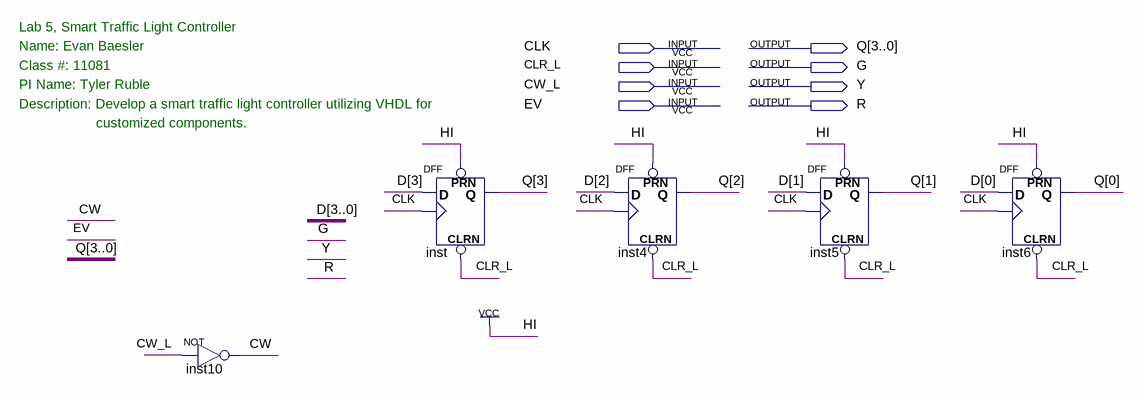
[diagram p0: schematic sheet]
// Quartus schematic Lab5_DFF_Traf_Cont.bdf as structural Verilog: 5 symbols, 8 pins
module Lab5_DFF_Traf_Cont (
  input  CLK,
  input  CLR_L,
  input  CW_L,
  input  EV,
  output [3:0] Q,
  output G,
  output Y,
  output R
);

  wire CW;
  wire [3:0] D;

  not inst10 (CW, CW_L);
  DFF inst (.CLRN(CLR_L), .CLK(CLK), .D(D[3]), .PRN(1'b1), .Q(Q[3]));
  DFF inst4 (.CLRN(CLR_L), .CLK(CLK), .D(D[2]), .PRN(1'b1), .Q(Q[2]));
  DFF inst5 (.CLRN(CLR_L), .CLK(CLK), .D(D[1]), .PRN(1'b1), .Q(Q[1]));
  DFF inst6 (.CLRN(CLR_L), .CLK(CLK), .D(D[0]), .PRN(1'b1), .Q(Q[0]));

  // Notes on the sheet:
  //   Lab 5, Smart Traffic Light Controller
  //   Name: Evan Baesler
  //   Class #: 11081
  //   PI Name: Tyler Ruble
  //   Description: Develop a smart traffic light controller utilizing VHDL for
  //   customized components.
endmodule
